# EAGLE schematic custom_keithly (EAGLE 9.3.0)
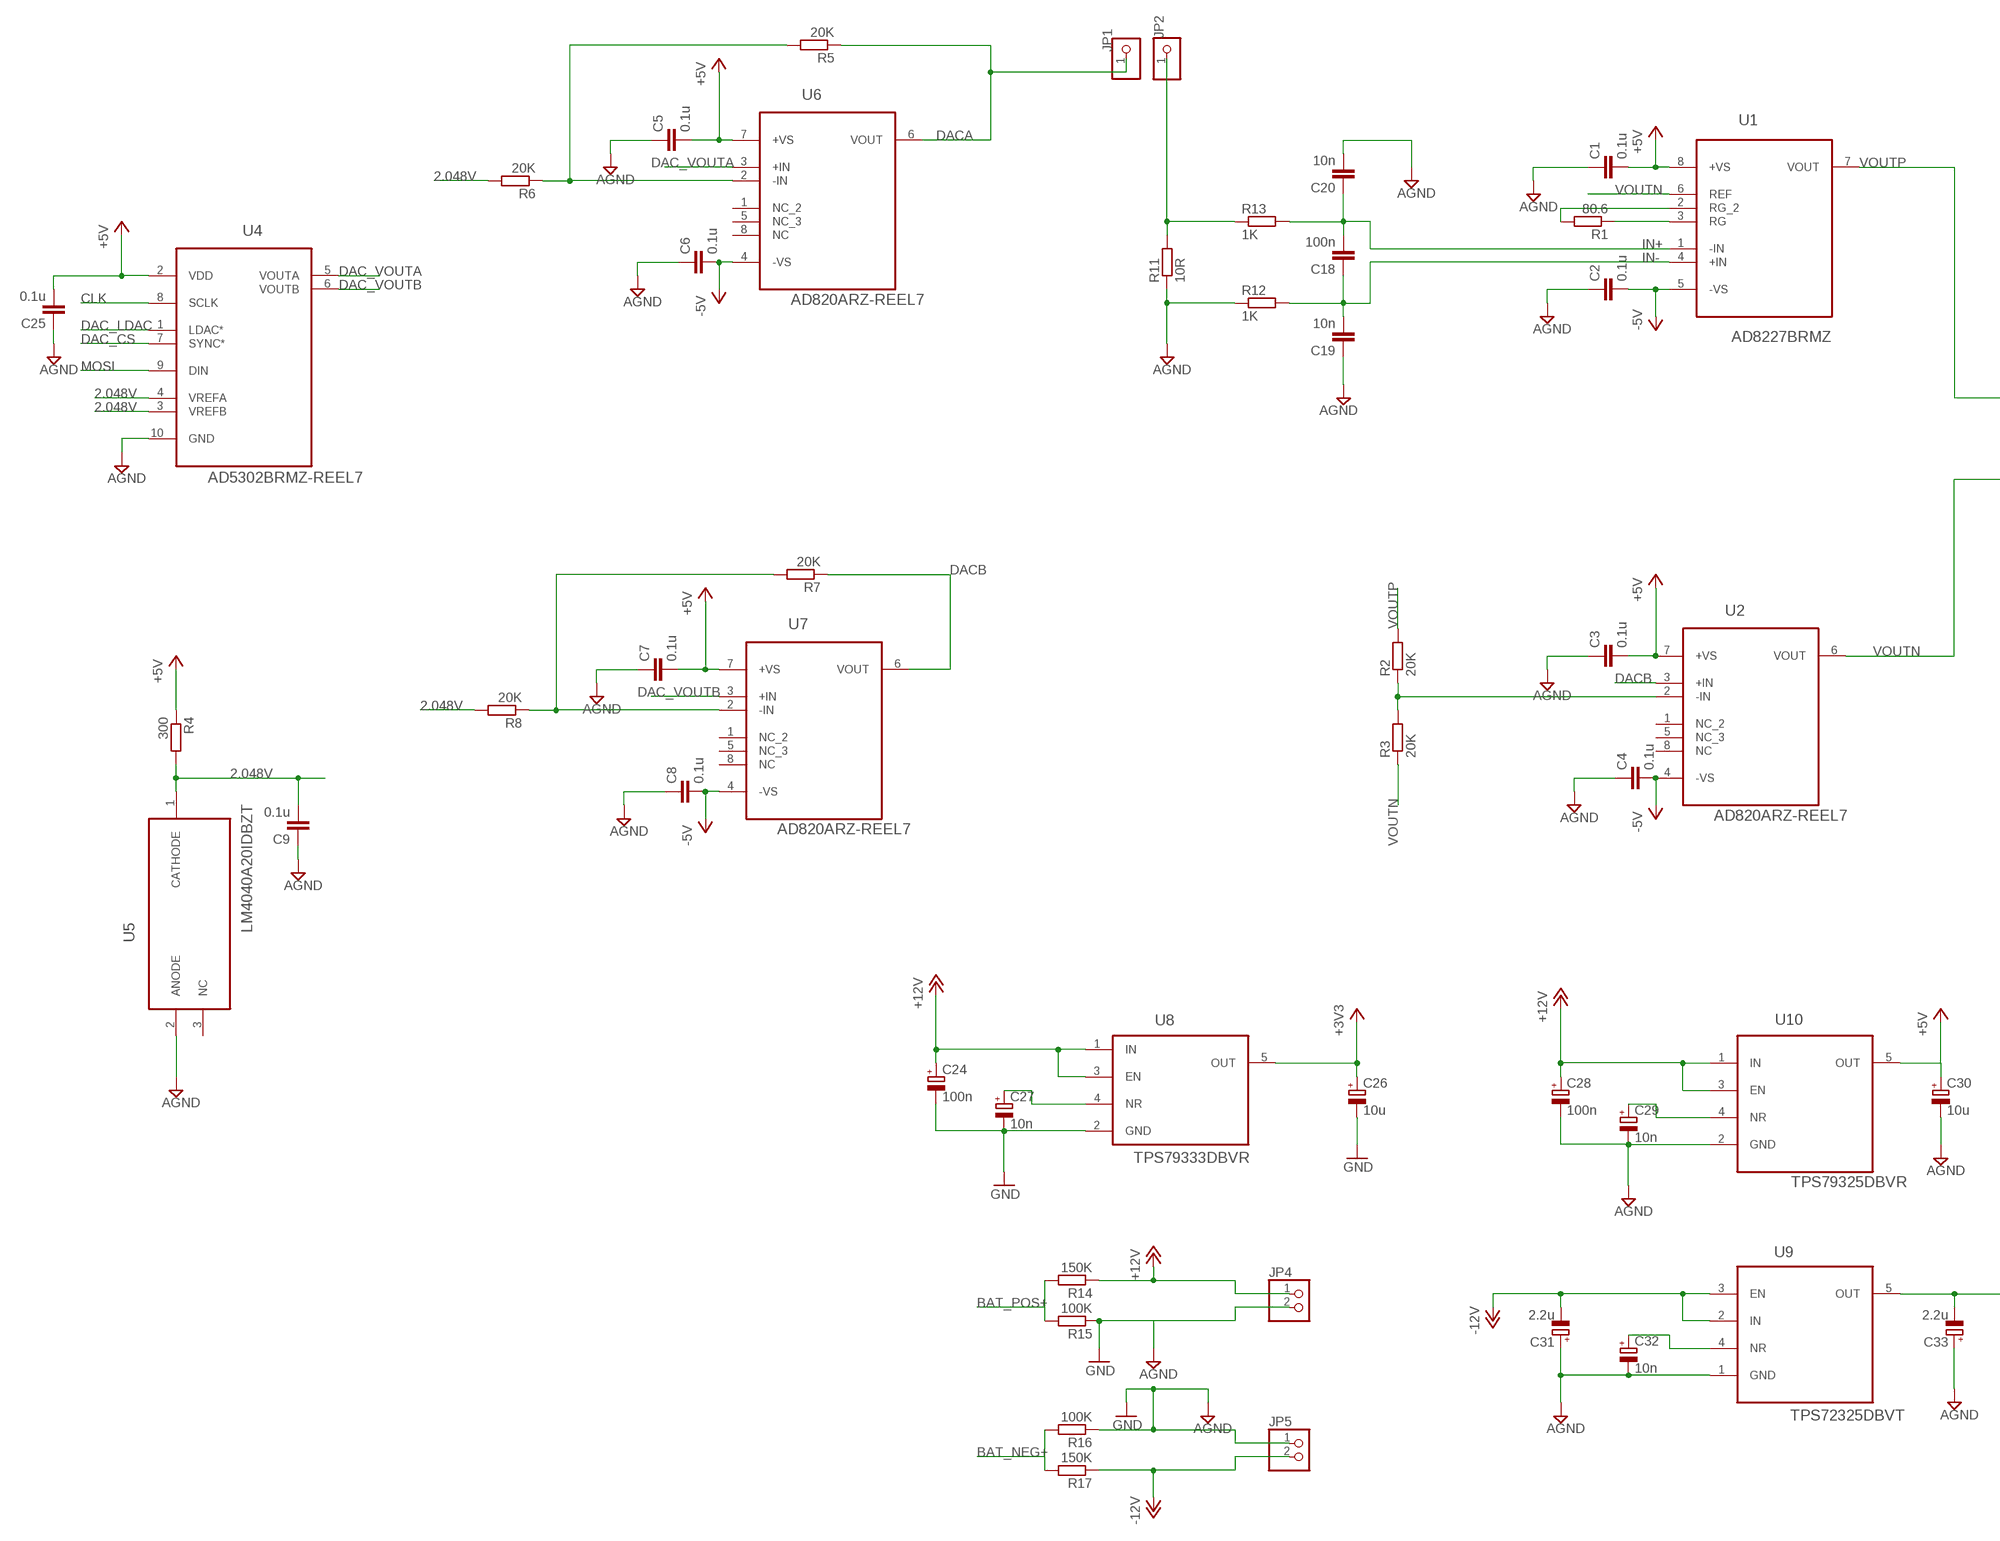
[diagram p0: schematic, sheet 1, part 1 of 2]
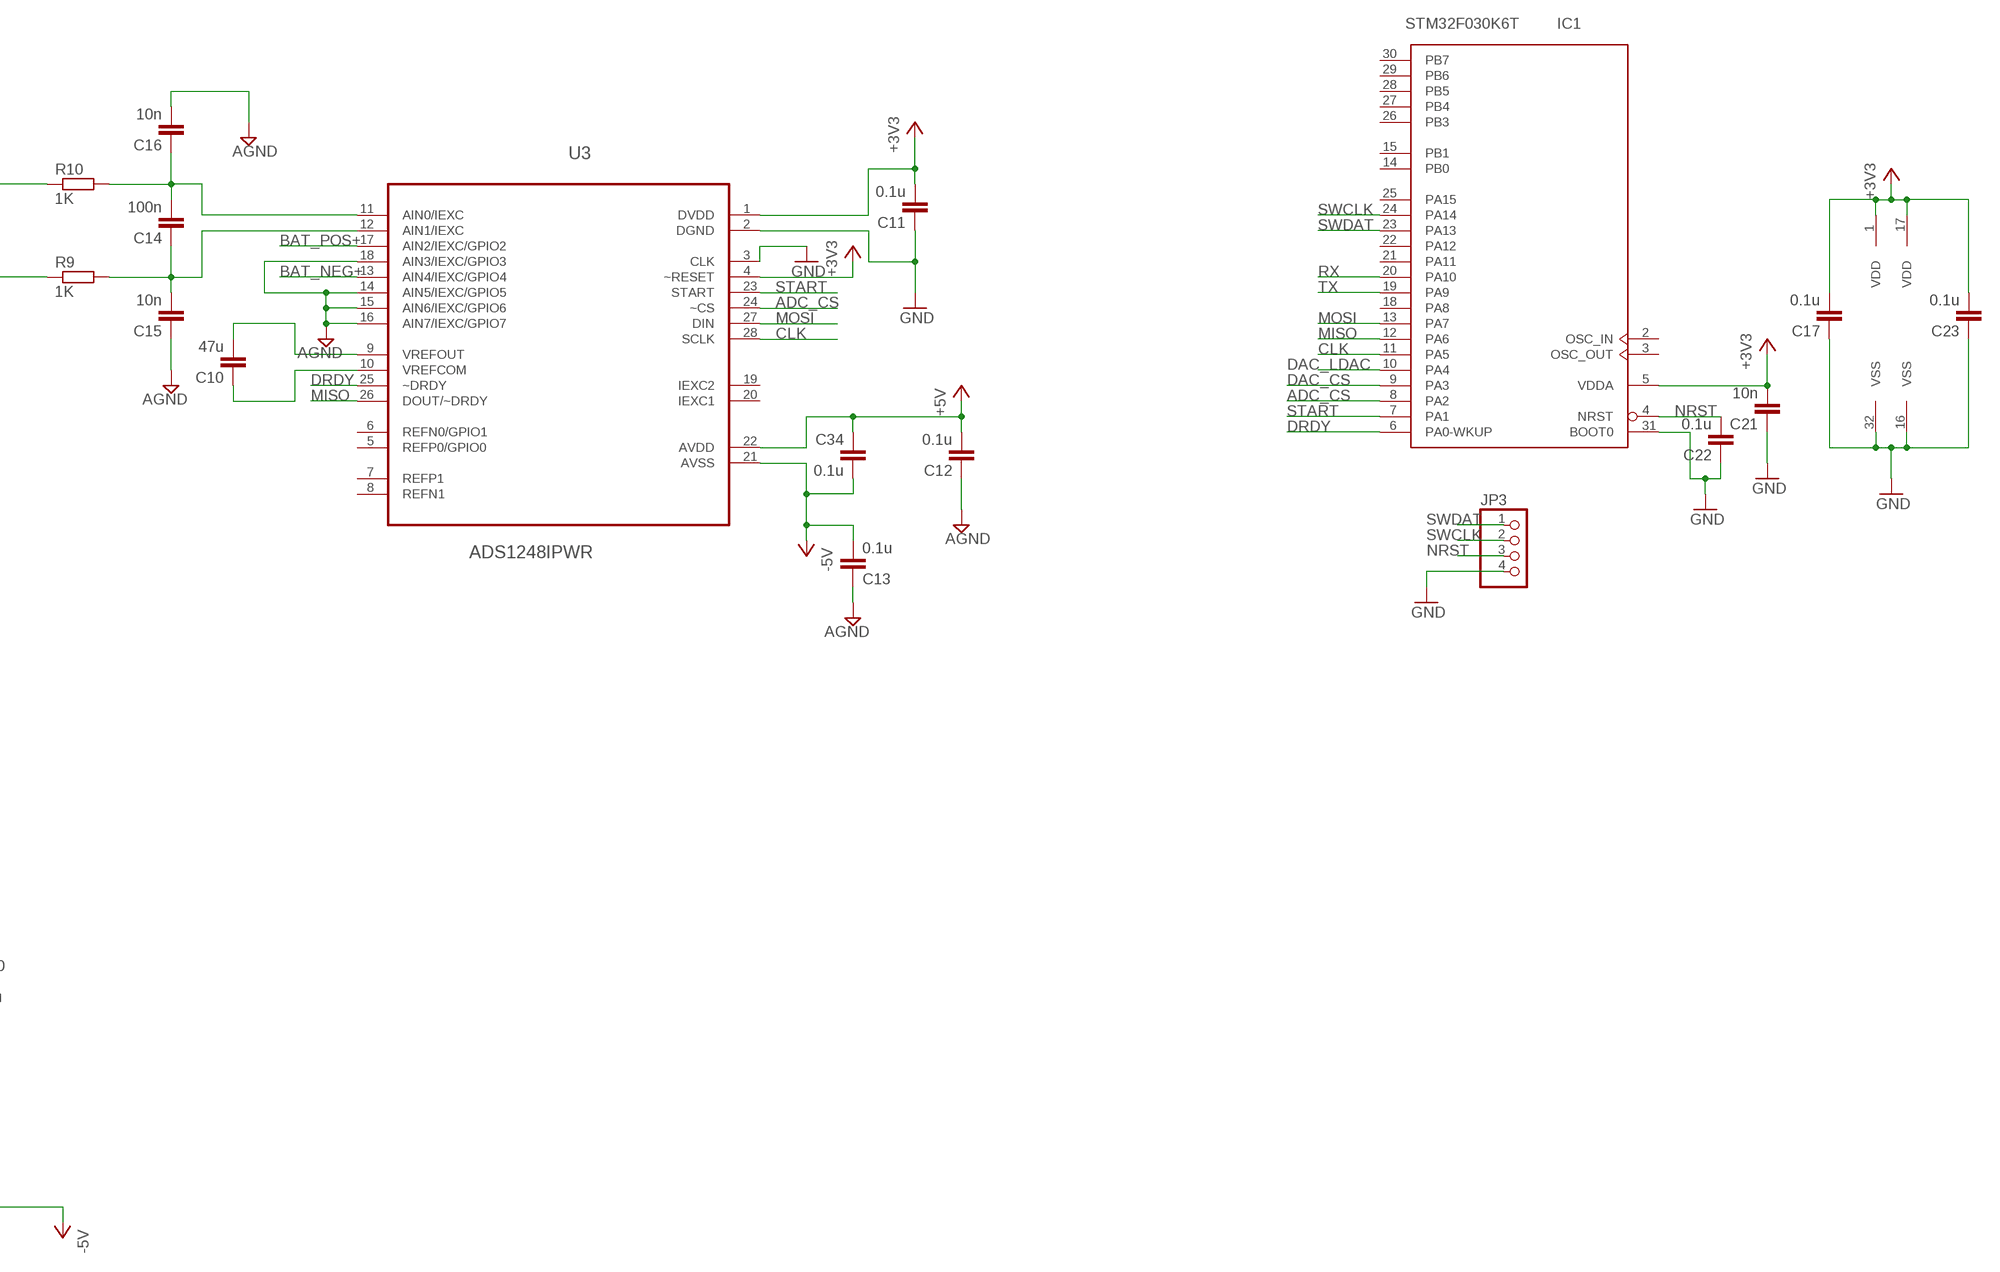
[diagram p1: schematic, sheet 1, part 2 of 2]

## Parts
C1  0.1u  C-EUC0603K  [C0603K]
C2  0.1u  C-EUC0603K  [C0603K]
C3  0.1u  C-EUC0603K  [C0603K]
C4  0.1u  C-EUC0603K  [C0603K]
C5  0.1u  C-EUC0603K  [C0603K]
C6  0.1u  C-EUC0603K  [C0603K]
C7  0.1u  C-EUC0603K  [C0603K]
C8  0.1u  C-EUC0603K  [C0603K]
C9  0.1u  C-EUC0603K  [C0603K]
C10  47u  C-EUC0603K  [C0603K]
C11  0.1u  C-EUC0603K  [C0603K]
C12  0.1u  C-EUC0603K  [C0603K]
C13  0.1u  C-EUC0603K  [C0603K]
C14  100n  C-EUC0603K  [C0603K]
C15  10n  C-EUC0603K  [C0603K]
C16  10n  C-EUC0603K  [C0603K]
C17  0.1u  C-EUC0603K  [C0603K]
C18  100n  C-EUC0603K  [C0603K]
C19  10n  C-EUC0603K  [C0603K]
C20  10n  C-EUC0603K  [C0603K]
C21  10n  C-EUC0603K  [C0603K]
C22  0.1u  C-EUC0603K  [C0603K]
C23  0.1u  C-EUC0603K  [C0603K]
C24  100n  CPOL-EUCT3216  [CT3216]
C25  0.1u  C-EUC0603K  [C0603K]
C26  10u  CPOL-EUCT3216  [CT3216]
C27  10n  CPOL-EUCT3216  [CT3216]
C28  100n  CPOL-EUCT3216  [CT3216]
C29  10n  CPOL-EUCT3216  [CT3216]
C30  10u  CPOL-EUCT3216  [CT3216]
C31  2.2u  CPOL-EUCT3216  [CT3216]
C32  10n  CPOL-EUCT3216  [CT3216]
C33  2.2u  CPOL-EUCT3216  [CT3216]
C34  0.1u  C-EUC0603K  [C0603K]
IC1  STM32F030K6T  [LQFP32]
JP1  PINHD-1X1  [1X01]
JP2  PINHD-1X1  [1X01]
JP3  PINHD-1X4  [1X04]
JP4  PINHD-1X2  [1X02]
JP5  PINHD-1X2  [1X02]
R1  80.6  R-EU_R0805  [R0805]
R2  20K  R-EU_R0603  [R0603]
R3  20K  R-EU_R0603  [R0603]
R4  300  R-EU_R0805  [R0805]
R5  20K  R-EU_R0603  [R0603]
R6  20K  R-EU_R0603  [R0603]
R7  20K  R-EU_R0603  [R0603]
R8  20K  R-EU_R0603  [R0603]
R9  1K  R-EU_R0805  [R0805]
R10  1K  R-EU_R0805  [R0805]
R11  10R  R-EU_R0805  [R0805]
R12  1K  R-EU_R0805  [R0805]
R13  1K  R-EU_R0805  [R0805]
R14  150K  R-EU_R0603  [R0603]
R15  100K  R-EU_R0603  [R0603]
R16  100K  R-EU_R0603  [R0603]
R17  150K  R-EU_R0603  [R0603]
U1  AD8227BRMZ  [SOP65P490X110-8N]
U2  AD820ARZ-REEL7  [SOIC127P600X175-8N]
U3  ADS1248IPWR  [SOP65P640X120-28N]
U4  AD5302BRMZ-REEL7  [SOP50P490X110-10N]
U5  LM4040A20IDBZT  [SOT95P237X112-3N]
U6  AD820ARZ-REEL7  [SOIC127P600X175-8N]
U7  AD820ARZ-REEL7  [SOIC127P600X175-8N]
U8  TPS79333DBVR  [SOT95P280X145-5N]
U9  TPS72325DBVT  [SOT95P280X145-5N]
U10  TPS79325DBVR  [SOT95P280X145-5N]

## Nets
2.048V: C9.2 R4.2 R6.2 R8.2 U4.3(VREFB) U4.4(VREFA) U5.1(CATHODE)
+3V3: C11.2 C17.2 C21.2 C23.2 C26.+ IC1.1(VDD) IC1.5(VDDA) IC1.17(VDD) U3.1(DVDD) U3.4(~RESET) U8.5(OUT)
+5V: C1.2 C3.2 C5.2 C7.2 C12.2 C25.2 C30.+ C34.1 R4.1 U1.8(+VS) U2.7(+VS) U3.22(AVDD) U4.2(VDD) U6.7(+VS) U7.7(+VS) U10.5(OUT)
+12V: C24.+ C28.+ JP4.1 R14.1 U8.1(IN) U8.3(EN) U10.1(IN) U10.3(EN)
-5V: C2.2 C4.2 C6.2 C8.2 C13.2 C33.- C34.2 U1.5(-VS) U2.4(-VS) U3.21(AVSS) U6.4(-VS) U7.4(-VS) U9.5(OUT)
-12V: C31.- JP5.2 R17.1 U9.2(IN) U9.3(EN)
ADC_CS: IC1.8(PA2) U3.24(~CS)
AGND: C1.1 C2.1 C3.1 C4.1 C5.1 C6.1 C7.1 C8.1 C9.1 C12.1 C13.1 C15.1 C16.2 C19.1 C20.2 C25.1 C28.- C29.- C30.- C31.+ C32.- C33.+ JP4.2 R11.1 R12.1 R15.1 U3.14(AIN5/IEXC/GPIO5) U3.15(AIN6/IEXC/GPIO6) U3.16(AIN7/IEXC/GPIO7) U3.18(AIN3/IEXC/GPIO3) U4.10(GND) U5.2(ANODE) U9.1(GND) U10.2(GND) ; supply symbol labelled GND
BAT_NEG+: R16.2 R17.2 U3.13(AIN4/IEXC/GPIO4)
BAT_POS+: R14.2 R15.2 U3.17(AIN2/IEXC/GPIO2)
CLK: IC1.11(PA5) U3.28(SCLK) U4.8(SCLK)
DAC_CS: IC1.9(PA3) U4.7(SYNC*)
DAC_LDAC: IC1.10(PA4) U4.1(LDAC*)
DAC_VOUTA: U4.5(VOUTA) U6.3(+IN)
DAC_VOUTB: U4.6(VOUTB) U7.3(+IN)
DACA: JP1.1 R5.1 U6.6(VOUT)
DACB: R7.1 U2.3(+IN) U7.6(VOUT)
DRDY: IC1.6(PA0-WKUP) U3.25(~DRDY)
GND: C11.1 C17.1 C21.1 C22.1 C23.1 C24.- C26.- C27.- IC1.16(VSS) IC1.31(BOOT0) IC1.32(VSS) JP3.4 JP5.1 R16.1 U3.2(DGND) U3.3(CLK) U8.2(GND) ; supply symbol labelled AGND
IN+: C18.2 C20.1 R13.2 U1.1(-IN)
IN-: C18.1 C19.2 R12.2 U1.4(+IN)
MISO: IC1.12(PA6) U3.26(DOUT/~DRDY)
MOSI: IC1.13(PA7) U3.27(DIN) U4.9(DIN)
N$1: R1.2 U1.2(RG_2)
N$2: R1.1 U1.3(RG)
N$3: R2.1 R3.2 U2.2(-IN)
N$4: C10.2 U3.9(VREFOUT)
N$5: R5.2 R6.1 U6.2(-IN)
N$6: C10.1 U3.10(VREFCOM)
N$7: R7.2 R8.1 U7.2(-IN)
N$8: C14.1 C15.2 R9.2 U3.12(AIN1/IEXC)
N$9: C14.2 C16.1 R10.2 U3.11(AIN0/IEXC)
N$10: C27.+
N$11: JP2.1 R11.2 R13.1
N$12: C29.+ U10.4(NR)
N$13: C32.+ U9.4(NR)
NRST: C22.2 IC1.4(NRST) JP3.3
RX: IC1.20(PA10)
START: IC1.7(PA1) U3.23(START)
SWCLK: IC1.24(PA14) JP3.2
SWDAT: IC1.23(PA13) JP3.1
TX: IC1.19(PA9)
VOUTN: R3.1 R9.1 U1.6(REF) U2.6(VOUT)
VOUTP: R2.2 R10.1 U1.7(VOUT)
Unconnected: IC1.2(OSC_IN) IC1.3(OSC_OUT) IC1.14(PB0) IC1.15(PB1) IC1.18(PA8) IC1.21(PA11) IC1.22(PA12) IC1.25(PA15) IC1.26(PB3) IC1.27(PB4) IC1.28(PB5) IC1.29(PB6) IC1.30(PB7) U2.1(NC_2) U2.5(NC_3) U2.8(NC) U3.5(REFP0/GPIO0) U3.6(REFN0/GPIO1) U3.7(REFP1) U3.8(REFN1) U3.19(IEXC2) U3.20(IEXC1) U5.3(NC) U6.1(NC_2) U6.5(NC_3) U6.8(NC) U7.1(NC_2) U7.5(NC_3) U7.8(NC) U8.4(NR)

## Library data of the parts
C1-C23 C25 C34 = resistor:C-EU: CAPACITOR, European symbol
C24 C26-C33 = rcl:CPOL-EU: POLARIZED CAPACITOR, European symbol; SPICEPREFIX: C
IC1 = micro-stm_v3:STM32F030K*T: ARM 32-bit Cortex™-M0 CPU 48 MHz maximum frequency 32 Kbytes of Flash memory 4 kbytes of SRAM 26 GPIOs 2.4 to 3.6 V application supply
JP1 JP2 = pinhead:PINHD-1X1: PIN HEADER
JP3 = pinhead:PINHD-1X4: PIN HEADER
JP4 JP5 = pinhead:PINHD-1X2: PIN HEADER
R1-R17 = resistor:R-EU_: RESISTOR, European symbol
U1 = Analog Devices_By_element14_Batch_1:AD8227BRMZ: Wide Supply Range, Rail-to-Rail Output Instrumentation Amplifier; MPN: AD8227BRMZ; OC_FARNELL: -; OC_NEWARK: 14R8718; PACKAGE: MSOP-8; SUPPLIER: Analog Devices
U2 U6 U7 = ADI-Phase-2:AD820ARZ-REEL7: FET Input Op Amp; MPN: AD820ARZ-REEL7; OC_FARNELL: unknown; OC_NEWARK: 88H0198; PACKAGE: SOIC-8; SUPPLIER: Analog Devices
U3 = Texas Instruments_By_element14_Batch_1:ADS1248IPWR: ADC; MPN: ADS1248IPWR; OC_FARNELL: -; OC_NEWARK: 09R3235; PACKAGE: TSSOP-28; SUPPLIER: Texas Instruments
U4 = ADI-Phase-2:AD5302BRMZ-REEL7: 8-/10-/12-Bit Digital-to-Analog Converters; MPN: AD5302BRMZ-REEL7; OC_FARNELL: unknown; OC_NEWARK: 59K3868; PACKAGE: MSOP-10; SUPPLIER: Analog Devices
U5 = Texas Instruments_By_element14_Batch_1:LM4040A20IDBZT: PRECISION MICROPOWER SHUNT VOLTAGE REFERENCE; MPN: LM4040A20IDBZT; OC_FARNELL: 1702826; OC_NEWARK: 53K9321; PACKAGE: 3-SOT-23; SUPPLIER: TEXAS INSTRUMENTS
U8 = Texas Instruments_By_element14_Batch_1:TPS79333DBVR: LOW-DROPOUT LINEAR REGULATORS; MPN: TPS79333DBVR; OC_FARNELL: 1470478; OC_NEWARK: 77C1365; PACKAGE: SOT-23-5; SUPPLIER: Texas Instruments
U9 = Texas Instruments_By_element14_Batch_1:TPS72325DBVT: 200mA Low-Noise, High-PSRR Negative Output Low-Dropout Linear Regulators; MPN: TPS72325DBVT; OC_FARNELL: -; OC_NEWARK: 87H2933; PACKAGE: SOT-23-5; SUPPLIER: Texas Instruments
U10 = Texas Instruments_By_element14_Batch_1:TPS79325DBVR: ULTRALOW-NOISE, HIGH PSRR, FAST RF 200mA LOW-DROPOUT LINEAR REGULATORS IN NanoStar? WAFER CHIP SCALE AND SOT23; MPN: TPS79325DBVR; OC_FARNELL: -; OC_NEWARK: 77C1360; PACKAGE: SOT-23-5; SUPPLIER: Texas Instruments